# Altium schematic sheet ESP32C3.SchDoc
size A4; DrawnBy: Emile Renaud; Revision: V1; SheetNumber: 1; SheetTotal: 1
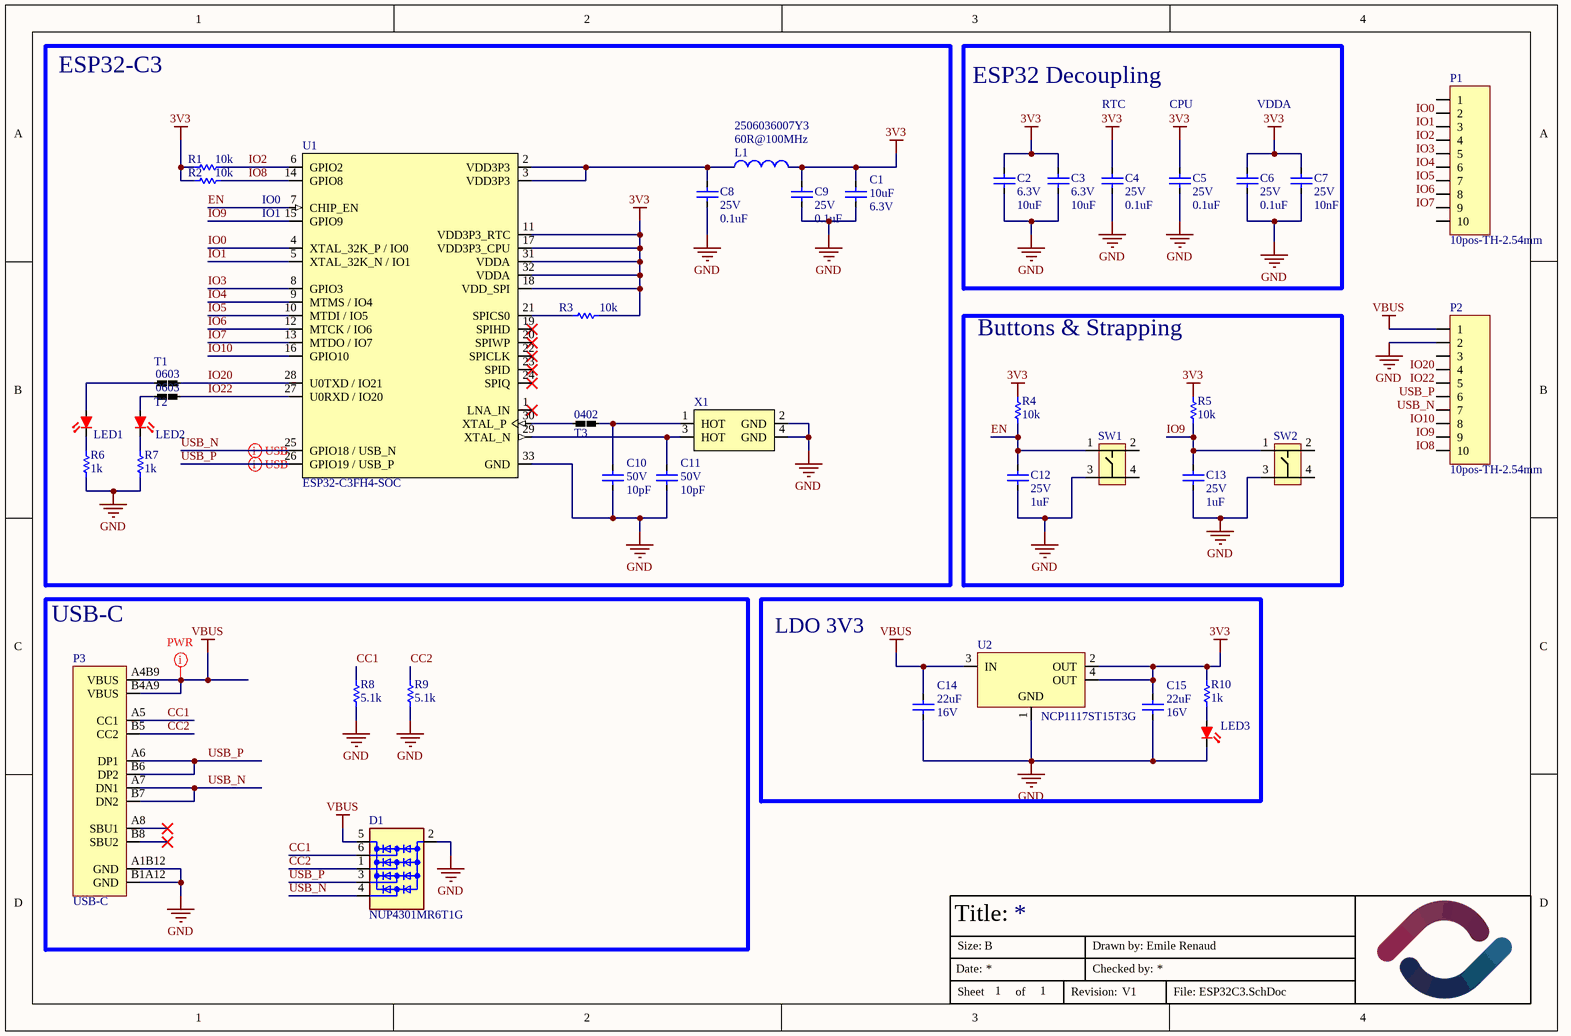
[diagram p0: ESP32C3.SchDoc]

## Parts
C1  value 10uF  Volt: 6.3V  [CAPACITOR-0603]  (hidden comment: Capacitor-0603-10uF-6.3V-X5R)
C2  value 10uF  Volt: 6.3V  [CAPACITOR-0603]  (hidden comment: Capacitor-0603-10uF-6.3V-X5R)
C3  value 10uF  Volt: 6.3V  [CAPACITOR-0603]  (hidden comment: Capacitor-0603-10uF-6.3V-X5R)
C4  value 0.1uF  Volt: 25V  [CAPACITOR-0402]  (hidden comment: Capacitor-0402-0.1uF-25V-X5R)
C5  value 0.1uF  Volt: 25V  [CAPACITOR-0402]  (hidden comment: Capacitor-0402-0.1uF-25V-X5R)
C6  value 0.1uF  Volt: 25V  [CAPACITOR-0402]  (hidden comment: Capacitor-0402-0.1uF-25V-X5R)
C7  value 10nF  Volt: 25V  [CAPACITOR-0402]  (hidden comment: Capacitor-0402-10nF-25V-X7R)
C8  value 0.1uF  Volt: 25V  [CAPACITOR-0402]  (hidden comment: Capacitor-0402-0.1uF-25V-X5R)
C9  value 0.1uF  Volt: 25V  [CAPACITOR-0402]  (hidden comment: Capacitor-0402-0.1uF-25V-X5R)
C10  value 10pF  Volt: 50V  [CAPACITOR-0402]  (hidden comment: Capacitor-0402-10pF-50V-C0G)
C11  value 10pF  Volt: 50V  [CAPACITOR-0402]  (hidden comment: Capacitor-0402-10pF-50V-C0G)
C12  value 1uF  Volt: 25V  [CAPACITOR-0603]  (hidden comment: Capacitor-0603-1uF-25V-X5R)
C13  value 1uF  Volt: 25V  [CAPACITOR-0603]  (hidden comment: Capacitor-0603-1uF-25V-X5R)
C14  value 22uF  Volt: 16V  [CAPACITOR-0805]  (hidden comment: Capacitor-0805-22uF-16V-X5R)
C15  value 22uF  Volt: 16V  [CAPACITOR-0805]  (hidden comment: Capacitor-0805-22uF-16V-X5R)
D1  NUP4301MR6T1G  [SOT-23-6]
L1  2506036007Y3  value 60R@100MHz  [CAPACITOR-0603]
LED1  B1911USD-20D000114U1930  [LED-0603-2PIN]  (value not drawn)
LED2  B1911USD-20D000114U1930  [LED-0603-2PIN]  (value not drawn)
LED3  B1911USD-20D000114U1930  [LED-0603-2PIN]  (value not drawn)
P1  10pos-TH-2.54mm  [HDR1X10]
P2  10pos-TH-2.54mm  [HDR1X10]
P3  USB-C  [USB-C]
R1  value 10k  [Resistor-0402]  (hidden comment: SMT resistor)
R2  value 10k  [Resistor-0402]  (hidden comment: SMT resistor)
R3  value 10k  [Resistor-0402]  (hidden comment: SMT resistor)
R4  value 10k  [Resistor-0603]  (hidden comment: SMT resistor)
R5  value 10k  [Resistor-0603]  (hidden comment: SMT resistor)
R6  value 1k  [Resistor-0603]  (hidden comment: SMT resistor)
R7  value 1k  [Resistor-0603]  (hidden comment: SMT resistor)
R8  value 5.1k  [Resistor-0603]  (hidden comment: SMT resistor)
R9  value 5.1k  [Resistor-0603]  (hidden comment: SMT resistor)
R10  value 1k  [Resistor-0603]  (hidden comment: SMT resistor)
SW1  PTS815 SJM 250 SMTR LFS  [SW4_PTS815 SJM 250 SMTR LFS_CNK]  (value not drawn)
SW2  PTS815 SJM 250 SMTR LFS  [SW4_PTS815 SJM 250 SMTR LFS_CNK]  (value not drawn)
T1  NetTie_0603_Short  [NetTie-0603-short]  (value not drawn)
T2  NetTie_0603_Short  [NetTie-0603-short]  (value not drawn)
T3  NetTie_0402  [NetTie-0402]  (value not drawn)
U1  ESP32-C3FH4-SOC  [VQFN-32-Exposed Pad]
U2  NCP1117ST15T3G  [SOT-223-3/TO-261-3S]
X1  CX2016DB40000D0FLJCC  [4-SMD]  (value not drawn)

## Blocks framed on the sheet
ESP32-C3: C1 C8-C11 L1 LED1 LED2 R1-R3 R6 R7 T1-T3 U1 X1
ESP32 Decoupling: C2-C7
Buttons & Strapping: C12 C13 R4 R5 SW1 SW2
USB-C: D1 P3 R8 R9
LDO 3V3: C14 C15 LED3 R10 U2

## Nets
3V3: C1.2 C2.2 C3.2 C4.2 C5.2 C6.2 C7.2 C9.2 C15.2 L1.2 R1.1 R2.1 R3.2 R4.2 R5.2 R10.2 U1.11(VDD3P3_RTC) U1.17(VDD3P3_CPU) U1.18(VDD_SPI) U1.31(VDDA) U1.32(VDDA) U2.2(OUT) U2.4(OUT)
GND: C1.1 C2.1 C3.1 C4.1 C5.1 C6.1 C7.1 C8.1 C9.1 C10.1 C11.1 C12.1 C13.1 C14.1 C15.1 D1.2(GND) LED3.1(K) P2.2 P3.A1B12(GND) P3.B1A12(GND) R6.2 R7.2 R8.1 R9.1 SW1.3 SW2.3 U1.33(GND) U2.1(GND) X1.2(GND) X1.4(GND)
VBUS: C14.2 D1.5(VDD) P2.1 P3.A4B9(VBUS) P3.B4A9(VBUS) U2.3(IN)
CC1: D1.6(L1) P3.A5(CC1) R8.2
CC2: D1.1(L2) P3.B5(CC2) R9.2
EN: C12.2 R4.1 SW1.1 U1.7(CHIP_EN)
IO0: P1.1 U1.4(XTAL_32K_P_/_IO0)
IO1: P1.2 U1.5(XTAL_32K_N_/_IO1)
IO2: P1.3 R1.2 U1.6(GPIO2)
IO3: P1.4 U1.8(GPIO3)
IO4: P1.5 U1.9(MTMS_/_IO4)
IO5: P1.6 U1.10(MTDI_/_IO5)
IO6: P1.7 U1.12(MTCK_/_IO6)
IO7: P1.8 U1.13(MTDO_/_IO7)
IO8: P2.9 R2.2 U1.14(GPIO8)
IO9: C13.2 P2.8 R5.1 SW2.1 U1.15(GPIO9)
IO10: P2.7 U1.16(GPIO10)
IO20: P2.3 T1.1 U1.28(U0TXD_/_IO21)
IO22: P2.4 T2.1 U1.27(U0RXD_/_IO20)
USB_N: D1.4(L4) P2.6 P3.A7(DN1) P3.B7(DN2) U1.25(GPIO18_/_USB_N)
USB_P: D1.3(L3) P2.5 P3.A6(DP1) P3.B6(DP2) U1.26(GPIO19_/_USB_P)
NetC8_2: C8.2 L1.1 U1.2(VDD3P3) U1.3(VDD3P3)
NetC10_2: C10.2 T3.1 X1.1(HOT)
NetC11_2: C11.2 U1.29(XTAL_N) X1.3(HOT)
NetLED1_1: LED1.1(K) R6.1
NetLED1_2: LED1.2(R) T1.2
NetLED2_1: LED2.1(K) R7.1
NetLED2_2: LED2.2(R) T2.2
NetLED3_2: LED3.2(R) R10.1
NetR3_1: R3.1 U1.21(SPICS0)
NetT3_2: T3.2 U1.30(XTAL_P)

Not connected (* = marked no-connect by the designer): P1 9 10; P2 10; P3 A8(SBU1)* B8(SBU2)*; SW1 2 4; SW2 2 4; U1 1(LNA_IN)* 19(SPIHD)* 20(SPIWP)* 22(SPICLK)* 23(SPID)* 24(SPIQ)*

## Layout directives
differential pair; differential pair class USB: USB_N, USB_P
net class Power: VBUS

## Notes on the sheet
- RTC
- CPU
- VDDA
- (near U1) IO0
- (near U1) IO1
- Title:
- Date:
- Size:
- B
- Drawn by:
- Checked by:
- Sheet
- of
- Revision:
- File:
- (in symbol NetTie_0402) 0402
- (in symbol NetTie_0603_Short) 0603

## Library data of the parts
C1-C3 = Capacitor-0603-10uF-6.3V-X5R: Capacitor-0603-10uF-6.3V-X5R, Low ESR, Low ESL; Precision: X5R-20%; Supplier 1: Arrow Electronics; Supplier Part Number 1: NMC0603X5R106M6.3TRP4KF; Mounted: Yes; Package / Case: Metric 1608 , EIA 0603
C4-C6 C8 C9 = Capacitor-0402-0.1uF-25V-X5R: Precision: X7R - 10%; Package / Case: 0402 (1005 Metric); Mounted: Yes; Supplier 1: Digi-Key; Supplier Part Number 1: 1276-1043-1-ND; Supplier 2: Digi-Key
C7 = Capacitor-0402-10nF-25V-X7R: Precision: X7R - 10%; Package / Case: 0402 (1005 Metric); Mounted: Yes; Supplier 1: Digi-Key; Supplier Part Number 1: 490-1312-1-ND; Supplier 2: Digi-Key
C10 C11 = Capacitor-0402-10pF-50V-C0G: Precision: C0G - 10%; Package / Case: 0402 (1005 Metric); Mounted: Yes; Supplier 1: Digi-Key; Supplier Part Number 1: 399-C0402C100K5GAC7867CT-ND; Supplier 2: Digi-Key; HelpURL: https://connect.kemet.com:7667/gateway/IntelliData-ComponentDocumentation/1.0/download/datasheet/C0402C100K5GACTU
C12 C13 = Capacitor-0603-1uF-25V-X5R: Precision: X5R-10%; Package / Case: Metric 1608, EIA 0603; Mounted: Yes; Supplier 1: Digi-Key; Supplier Part Number 1: 1276-1859-2-ND; Supplier 2: Digi-Key; Supplier Part Number 2: 1276-1942-2-ND
C14 C15 = Capacitor-0805-22uF-16V-X5R: Precision: X5R-10%; Package / Case: Metric 2012 , EIA 0805; Mounted: Yes; Supplier 1: Digi-Key; Supplier Part Number 1: 1276-6780-1-ND; Supplier 2: Digi-Key; Supplier 3: Digi-Key; Supplier 4: Digi-Key
D1 = NUP4301MR6T1G: 4CH Clamp Ipp Tvs Diode Surface Mount SOT23-6 (SC74); Volt: 70; Supplier 1: Digi-Key; Supplier Part Number 1: NUP4301MR6T1GOSTR-ND; Mounted: Yes; Package / Case: SOT23-6
L1 = 2506036007Y3: 60 Ohms @ 100 MHz 1 Signal Line Ferrite Bead 0603 (1608 Metric) 3A 40mOhm; Supplier 1: Digi-Key; Mounted: Yes; Supplier Part Number 1: 1934-1396-1-ND; Package / Case: SMD; Current: 3A
LED1-LED3 = B1911USD-20D000114U1930: LED RED CLEAR 1608 SMD; Package / Case: 0603 (1608 Metric); Mounted: Yes; Supplier 1: Digi-Key; Supplier Part Number 1: 3147-B1911USD-20D000114U1930CT-ND
P1 P2 = 10pos-TH-2.54mm: 10pos TH 2.54mm Header; Supplier 1: Digi-Key; Supplier Part Number 1: N/A; Mounted: Yes; Package / Case: TH; Volt: N/A
P3 = USB-C: TYPEC-304J-BCP16 / 5A USB 3.1 1 Type-C SMD USB Connectors; Supplier 1: LCSC; Supplier Part Number 1: TYPEC-304J-BCP16; Mounted: Yes; Package / Case: SMD; Volt: N/A
R1-R3 = Resistor-0402-10k: Precision: 1%; Watt: 1/16W; Mounted: Yes; Package / Case: Metric 1005, EIA 0402; Supplier 1: Digi-Key; Supplier Part Number 1: 311-10.0KLRCT-ND
R4 R5 = Resistor0603-10k: Precision: 1%; Watt: 0.1W; Mounted: Yes; Package / Case: Metric 1608, EIA 0603; Supplier 2: Digi-Key; Supplier 4: Digi-Key; Supplier Part Number 2: RMCF0603FT10K0TR-ND; Supplier 1: Digi-Key; Supplier 3: Digi-Key; Supplier Part Number 1: 311-10.0KHRTR-ND
R6 R7 R10 = Resistor-0603-1k: Resistor0603-1k; Precision: 1%; Watt: 0.1W; Mounted: Yes; Package / Case: Metric 1608, EIA 0603; Supplier 1: Digi-Key; Supplier Part Number 1: 311-1.00KHRCT-ND
R8 R9 = Resistor-0603-5.1k: Precision: 1%; Watt: 0.1W; Mounted: Yes; Package / Case: Metric 1608, EIA 0603; Supplier 1: Digi-Key; Supplier Part Number 1: 311-5.10KHRCT-ND
SW1 SW2 = PTS815 SJM 250 SMTR LFS: TACT 4.2 X 3.2, 2.5 MM H, 180GF,; Volt: 12V; Current: 0.05A; Supplier 1: Digi-Key; Supplier Part Number 1: CKN12215-1-ND; Mounted: Yes
U1 = ESP32-C3FH4-SOC: Bluetooth, WiFi 802.11b/g/n, Bluetooth v5.0 Transceiver Module 2.402GHz ~ 2.48GHz Antenna Not Included Surface Mount; MF: Espressif Systems; Availability: In Stock; MP: ESP32-C3FH4; Package: VFQFN-32 Espressif Systems; DigiKey Link: https://www.digikey.ca/en/products/detail/espressif-systems/ESP32-C3FH4/14115592; HelpURL: https://www.espressif.com/sites/default/files/documentation/esp32-c3_datasheet_en.pdf; Supplier 1: Digikey; Supplier Part Number 1: 1904-ESP32-C3FH4CT-ND
U2 = NCP1117ST15T3G: IC REG LINEAR 3.3V 1A SOT223; Supplier 1: Digi-Key; Supplier Part Number 1: NCV1117ST33T3GOSCT-ND; Package / Case: SOT223; Mounted: Yes
X1 = CX2016DB40000D0FLJCC: 40 MHz ±10ppm Crystal 8pF 50 Ohms 4-SMD, No Lead; Supplier 1: Digikey; Supplier Part Number 1: 478-CX2016DB40000D0FLJCCCT-ND; Parameter 1: *